# Altium schematic sheet FPGA2.SchDoc
size A4; SheetNumber: 8; SheetTotal: 9
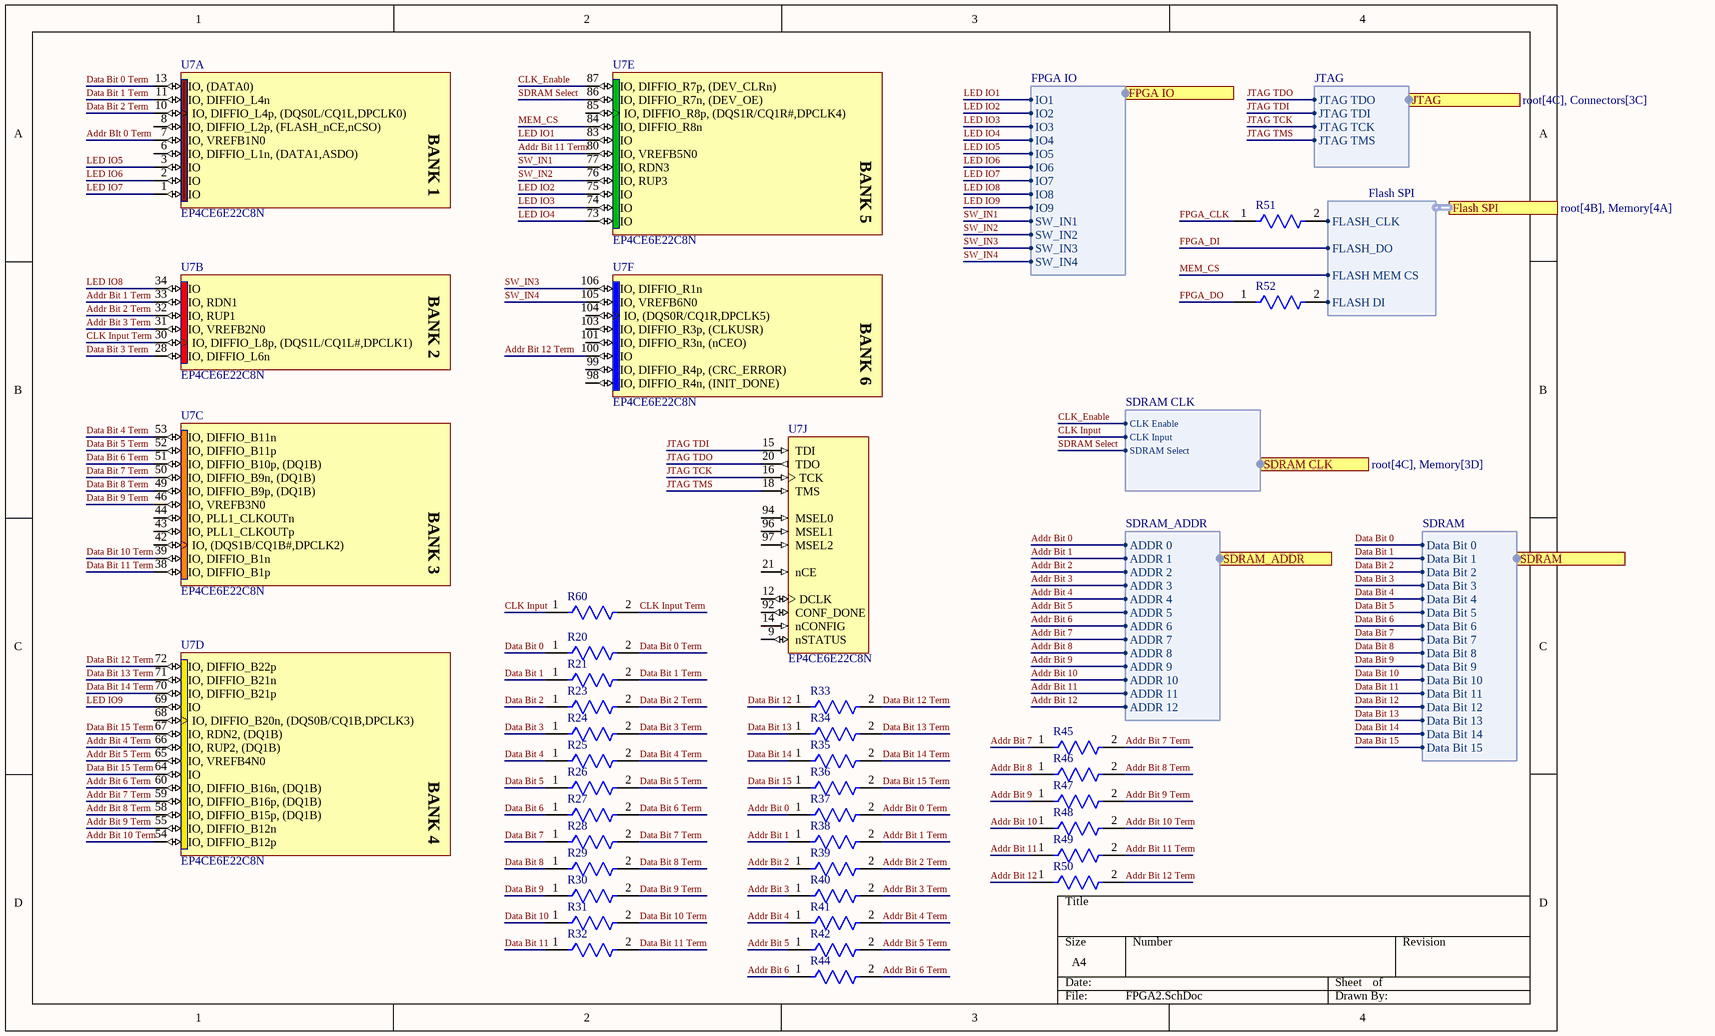
[diagram p0: FPGA2.SchDoc]

## Parts
R20  RT0402BRE0750RL  [FP-RT0402-0_35-MFG]  (value not drawn)
R21  RT0402BRE0750RL  [FP-RT0402-0_35-MFG]  (value not drawn)
R23  RT0402BRE0750RL  [FP-RT0402-0_35-MFG]  (value not drawn)
R24  RT0402BRE0750RL  [FP-RT0402-0_35-MFG]  (value not drawn)
R25  RT0402BRE0750RL  [FP-RT0402-0_35-MFG]  (value not drawn)
R26  RT0402BRE0750RL  [FP-RT0402-0_35-MFG]  (value not drawn)
R27  RT0402BRE0750RL  [FP-RT0402-0_35-MFG]  (value not drawn)
R28  RT0402BRE0750RL  [FP-RT0402-0_35-MFG]  (value not drawn)
R29  RT0402BRE0750RL  [FP-RT0402-0_35-MFG]  (value not drawn)
R30  RT0402BRE0750RL  [FP-RT0402-0_35-MFG]  (value not drawn)
R31  RT0402BRE0750RL  [FP-RT0402-0_35-MFG]  (value not drawn)
R32  RT0402BRE0750RL  [FP-RT0402-0_35-MFG]  (value not drawn)
R33  RT0402BRE0750RL  [FP-RT0402-0_35-MFG]  (value not drawn)
R34  RT0402BRE0750RL  [FP-RT0402-0_35-MFG]  (value not drawn)
R35  RT0402BRE0750RL  [FP-RT0402-0_35-MFG]  (value not drawn)
R36  RT0402BRE0750RL  [FP-RT0402-0_35-MFG]  (value not drawn)
R37  RT0402BRE0750RL  [FP-RT0402-0_35-MFG]  (value not drawn)
R38  RT0402BRE0750RL  [FP-RT0402-0_35-MFG]  (value not drawn)
R39  RT0402BRE0750RL  [FP-RT0402-0_35-MFG]  (value not drawn)
R40  RT0402BRE0750RL  [FP-RT0402-0_35-MFG]  (value not drawn)
R41  RT0402BRE0750RL  [FP-RT0402-0_35-MFG]  (value not drawn)
R42  RT0402BRE0750RL  [FP-RT0402-0_35-MFG]  (value not drawn)
R44  RT0402BRE0750RL  [FP-RT0402-0_35-MFG]  (value not drawn)
R45  RT0402BRE0750RL  [FP-RT0402-0_35-MFG]  (value not drawn)
R46  RT0402BRE0750RL  [FP-RT0402-0_35-MFG]  (value not drawn)
R47  RT0402BRE0750RL  [FP-RT0402-0_35-MFG]  (value not drawn)
R48  RT0402BRE0750RL  [FP-RT0402-0_35-MFG]  (value not drawn)
R49  RT0402BRE0750RL  [FP-RT0402-0_35-MFG]  (value not drawn)
R50  RT0402BRE0750RL  [FP-RT0402-0_35-MFG]  (value not drawn)
R51  RT0402BRE0750RL  [FP-RT0402-0_35-MFG]  (value not drawn)
R52  RT0402BRE0750RL  [FP-RT0402-0_35-MFG]  (value not drawn)
R60  RT0402BRE0750RL  [FP-RT0402-0_35-MFG]  (value not drawn)
U7  EP4CE6E22C8N  [EQFP144_A-165_D2-54_M]  (parts A,B,C,D,E,F,J of 13)

## Ports
Flash SPI (harness Flash SPI, see root[4B], Memory[4A]), FPGA IO (harness FPGA IO, see root[4B], IOs[1A]), JTAG (harness JTAG, see root[4C], Connectors[3C]), SDRAM (harness SDRAM, see root[4B], Memory[3B]), SDRAM CLK (harness SDRAM CLK, see root[4C], Memory[3D]), SDRAM_ADDR (harness SDRAM_ADDR, see root[4B], Memory[3C])

## Harnesses
JTAG: JTAG TDO, JTAG TDI, JTAG TCK, JTAG TMS
FPGA IO: IO1, IO2, IO3, IO4, IO5, IO6, IO7, IO8, IO9, SW_IN1, SW_IN2, SW_IN3, SW_IN4
Flash SPI: FLASH_CLK, FLASH_DO, FLASH MEM CS, FLASH DI
SDRAM: Data Bit 0, Data Bit 1, Data Bit 2, Data Bit 3, Data Bit 4, Data Bit 5, Data Bit 6, Data Bit 7, Data Bit 8, Data Bit 9, Data Bit 10, Data Bit 11, Data Bit 12, Data Bit 13, Data Bit 14, Data Bit 15
SDRAM_ADDR: ADDR 0, ADDR 1, ADDR 2, ADDR 3, ADDR 4, ADDR 5, ADDR 6, ADDR 7, ADDR 8, ADDR 9, ADDR 10, ADDR 11, ADDR 12
SDRAM CLK: CLK Enable, CLK Input, SDRAM Select

## Nets
Addr Bit 0: R37.1 ; port SDRAM_ADDR.ADDR 0
Addr BIt 0 Term: R37.2 U7.7(IO,_VREFB1N0)
Addr Bit 1: R38.1 ; port SDRAM_ADDR.ADDR 1
Addr Bit 1 Term: R38.2 U7.33(IO,_RDN1)
Addr Bit 2: R39.1 ; port SDRAM_ADDR.ADDR 2
Addr Bit 2 Term: R39.2 U7.32(IO,_RUP1)
Addr Bit 3: R40.1 ; port SDRAM_ADDR.ADDR 3
Addr Bit 3 Term: R40.2 U7.31(IO,_VREFB2N0)
Addr Bit 4: R41.1 ; port SDRAM_ADDR.ADDR 4
Addr Bit 4 Term: R41.2 U7.66(IO,_RUP2,_(DQ1B))
Addr Bit 5: R42.1 ; port SDRAM_ADDR.ADDR 5
Addr Bit 5 Term: R42.2 U7.65(IO,_VREFB4N0)
Addr Bit 6: R44.1 ; port SDRAM_ADDR.ADDR 6
Addr Bit 6 Term: R44.2 U7.60(IO,_DIFFIO_B16n,_(DQ1B))
Addr Bit 7: R45.1 ; port SDRAM_ADDR.ADDR 7
Addr Bit 7 Term: R45.2 U7.59(IO,_DIFFIO_B16p,_(DQ1B))
Addr Bit 8: R46.1 ; port SDRAM_ADDR.ADDR 8
Addr Bit 8 Term: R46.2 U7.58(IO,_DIFFIO_B15p,_(DQ1B))
Addr Bit 9: R47.1 ; port SDRAM_ADDR.ADDR 9
Addr Bit 9 Term: R47.2 U7.55(IO,_DIFFIO_B12n)
Addr Bit 10: R48.1 ; port SDRAM_ADDR.ADDR 10
Addr Bit 10 Term: R48.2 U7.54(IO,_DIFFIO_B12p)
Addr Bit 11: R49.1 ; port SDRAM_ADDR.ADDR 11
Addr Bit 11 Term: R49.2 U7.80(IO,_VREFB5N0)
Addr Bit 12: R50.1 ; port SDRAM_ADDR.ADDR 12
Addr Bit 12 Term: R50.2 U7.100(IO)
CLK Input: R60.1 ; port SDRAM CLK.CLK Input
CLK Input Term: R60.2 U7.30(IO,_DIFFIO_L8p,_(DQS1L/CQ1L#,DPCLK1))
CLK_Enable: U7.87(IO,_DIFFIO_R7p,_(DEV_CLRn)) ; port SDRAM CLK.CLK Enable
Data Bit 0: R20.1 ; port SDRAM.Data Bit 0
Data Bit 0 Term: R20.2 U7.13(IO,_(DATA0))
Data Bit 1: R21.1 ; port SDRAM.Data Bit 1
Data Bit 1 Term: R21.2 U7.11(IO,_DIFFIO_L4n)
Data Bit 2: R23.1 ; port SDRAM.Data Bit 2
Data Bit 2 Term: R23.2 U7.10(IO,_DIFFIO_L4p,_(DQS0L/CQ1L,DPCLK0))
Data Bit 3: R24.1 ; port SDRAM.Data Bit 3
Data Bit 3 Term: R24.2 U7.28(IO,_DIFFIO_L6n)
Data Bit 4: R25.1 ; port SDRAM.Data Bit 4
Data Bit 4 Term: R25.2 U7.53(IO,_DIFFIO_B11n)
Data Bit 5: R26.1 ; port SDRAM.Data Bit 5
Data Bit 5 Term: R26.2 U7.52(IO,_DIFFIO_B11p)
Data Bit 6: R27.1 ; port SDRAM.Data Bit 6
Data Bit 6 Term: R27.2 U7.51(IO,_DIFFIO_B10p,_(DQ1B))
Data Bit 7: R28.1 ; port SDRAM.Data Bit 7
Data Bit 7 Term: R28.2 U7.50(IO,_DIFFIO_B9n,_(DQ1B))
Data Bit 8: R29.1 ; port SDRAM.Data Bit 8
Data Bit 8 Term: R29.2 U7.49(IO,_DIFFIO_B9p,_(DQ1B))
Data Bit 9: R30.1 ; port SDRAM.Data Bit 9
Data Bit 9 Term: R30.2 U7.46(IO,_VREFB3N0)
Data Bit 10: R31.1 ; port SDRAM.Data Bit 10
Data Bit 10 Term: R31.2 U7.39(IO,_DIFFIO_B1n)
Data Bit 11: R32.1 ; port SDRAM.Data Bit 11
Data Bit 11 Term: R32.2 U7.38(IO,_DIFFIO_B1p)
Data Bit 12: R33.1 ; port SDRAM.Data Bit 12
Data Bit 12 Term: R33.2 U7.72(IO,_DIFFIO_B22p)
Data Bit 13: R34.1 ; port SDRAM.Data Bit 13
Data Bit 13 Term: R34.2 U7.71(IO,_DIFFIO_B21n)
Data Bit 14: R35.1 ; port SDRAM.Data Bit 14
Data Bit 14 Term: R35.2 U7.70(IO,_DIFFIO_B21p)
Data Bit 15: R36.1 ; port SDRAM.Data Bit 15
Data Bit 15 Term: R36.2 U7.64(IO) U7.67(IO,_RDN2,_(DQ1B))
FPGA_CLK: R51.1
FPGA_DI: port Flash SPI.FLASH_DO
FPGA_DO: R52.1
JTAG TCK: U7.16(TCK) ; port JTAG.JTAG TCK
JTAG TDI: U7.15(TDI) ; port JTAG.JTAG TDI
JTAG TDO: U7.20(TDO) ; port JTAG.JTAG TDO
JTAG TMS: U7.18(TMS) ; port JTAG.JTAG TMS
LED IO1: U7.83(IO) ; port FPGA IO.IO1
LED IO2: U7.75(IO) ; port FPGA IO.IO2
LED IO3: U7.74(IO) ; port FPGA IO.IO3
LED IO4: U7.73(IO) ; port FPGA IO.IO4
LED IO5: U7.3(IO) ; port FPGA IO.IO5
LED IO6: U7.2(IO) ; port FPGA IO.IO6
LED IO7: U7.1(IO) ; port FPGA IO.IO7
LED IO8: U7.34(IO) ; port FPGA IO.IO8
LED IO9: U7.69(IO) ; port FPGA IO.IO9
MEM_CS: U7.84(IO,_DIFFIO_R8n) ; port Flash SPI.FLASH MEM CS
SDRAM Select: U7.86(IO,_DIFFIO_R7n,_(DEV_OE)) ; port SDRAM CLK.SDRAM Select
SW_IN1: U7.77(IO,_RDN3) ; port FPGA IO.SW_IN1
SW_IN2: U7.76(IO,_RUP3) ; port FPGA IO.SW_IN2
SW_IN3: U7.106(IO,_DIFFIO_R1n) ; port FPGA IO.SW_IN3
SW_IN4: U7.105(IO,_VREFB6N0) ; port FPGA IO.SW_IN4
NetR51_2: R51.2 ; port Flash SPI.FLASH_CLK
NetR52_2: R52.2 ; port Flash SPI.FLASH DI

Not connected (* = marked no-connect by the designer): U7 6(IO,_DIFFIO_L1n,_(DATA1,ASDO)) 8(IO,_DIFFIO_L2p,_(FLASH_nCE,nCSO)) 9(nSTATUS) 12(DCLK) 14(nCONFIG) 21(nCE) 42(IO,_(DQS1B/CQ1B#,DPCLK2)) 43(IO,_PLL1_CLKOUTp) 44(IO,_PLL1_CLKOUTn) 68(IO,_DIFFIO_B20n,_(DQS0B/CQ1B,DPCLK3)) 85(IO,_DIFFIO_R8p,_(DQS1R/CQ1R#,DPCLK4)) 92(CONF_DONE) 94(MSEL0) 96(MSEL1) 97(MSEL2) 98(IO,_DIFFIO_R4n,_(INIT_DONE)) 99(IO,_DIFFIO_R4p,_(CRC_ERROR)) 101(IO,_DIFFIO_R3n,_(nCEO)) 103(IO,_DIFFIO_R3p,_(CLKUSR)) 104(IO,_(DQS0R/CQ1R,DPCLK5))

## Notes on the sheet
- (in symbol CMP-0038-00212-1, part A) BANK 1
- (in symbol CMP-0038-00212-1, part B) BANK 2
- (in symbol CMP-0038-00212-1, part C) BANK 3
- (in symbol CMP-0038-00212-1, part D) BANK 4
- (in symbol CMP-0038-00212-1, part E) BANK 5
- (in symbol CMP-0038-00212-1, part F) BANK 6

## Library data of the parts
R20 R21 R23-R42 R44-R52 R60 = CMP-00621-71392720-1: RT0402BRE0750RL Fixed Resistor, Thin Film, 0.0625W, 50ohm, 50V, 0.1% +/-Tol, 50ppm/Cel, Surface Mount, 0402; Max Power Dissipation: 63mW; Temperature Coefficient: 50ppm/°C; Resistance: 50Ω; Features: Moisture Resistant; Max Operating Temperature: 155°C; Tolerance: 0.1%; Min Operating Temperature: -55°C; Case/Package: 0402; Packaging: Tape & Reel; RoHS: Compliant; Width: 508µm; Height: 355.6µm; NexarPartId: 71392720; Composition: Thin Film; Length: 990.6µm; Number of Terminations: 2
U7 = CMP-0038-00212-1: Cyclone IV Family FPGA, 1.2V Core, 91 I/O Pins, 2 PLLs, 144-Pin QFP, Speed Grade 8, Commercial Grade, Pb-Free; Manufacturer: Altera; ComponentLink3Description: Pinout; ComponentLink4Description: Package Specification; DatasheetVersion: ver1.6, Nov-2011; ComponentLink1URL: http://www.altera.com/; ComponentLink2URL: http://www.altera.com/literature/hb/cyclone-iv/cyclone4-handbook.pdf; ComponentLink2Description: Handbook; PackageReference: EQFP144_A-165_D2-54; ComponentLink3URL: http://www.altera.com/literature/lit-dp.jsp?category=cyc%204&showspreadsheet=y; PackageVersion: ver1.0, Jan-2011; ComponentLink1Description: Manufacturer URL; ComponentLink4URL: http://www.altera.com/devicepackaging/04R00402-00.pdf; PackageDescription: 144-Pin Plastic Enhanced Quad Flat Pack (EQFP) - Wire Bond - A:1.65 - D2:5.4; Code_JEDEC: MS-026-BFB-HD